# Altium schematic sheet STM32F103最小系统板.SchDoc
size A3
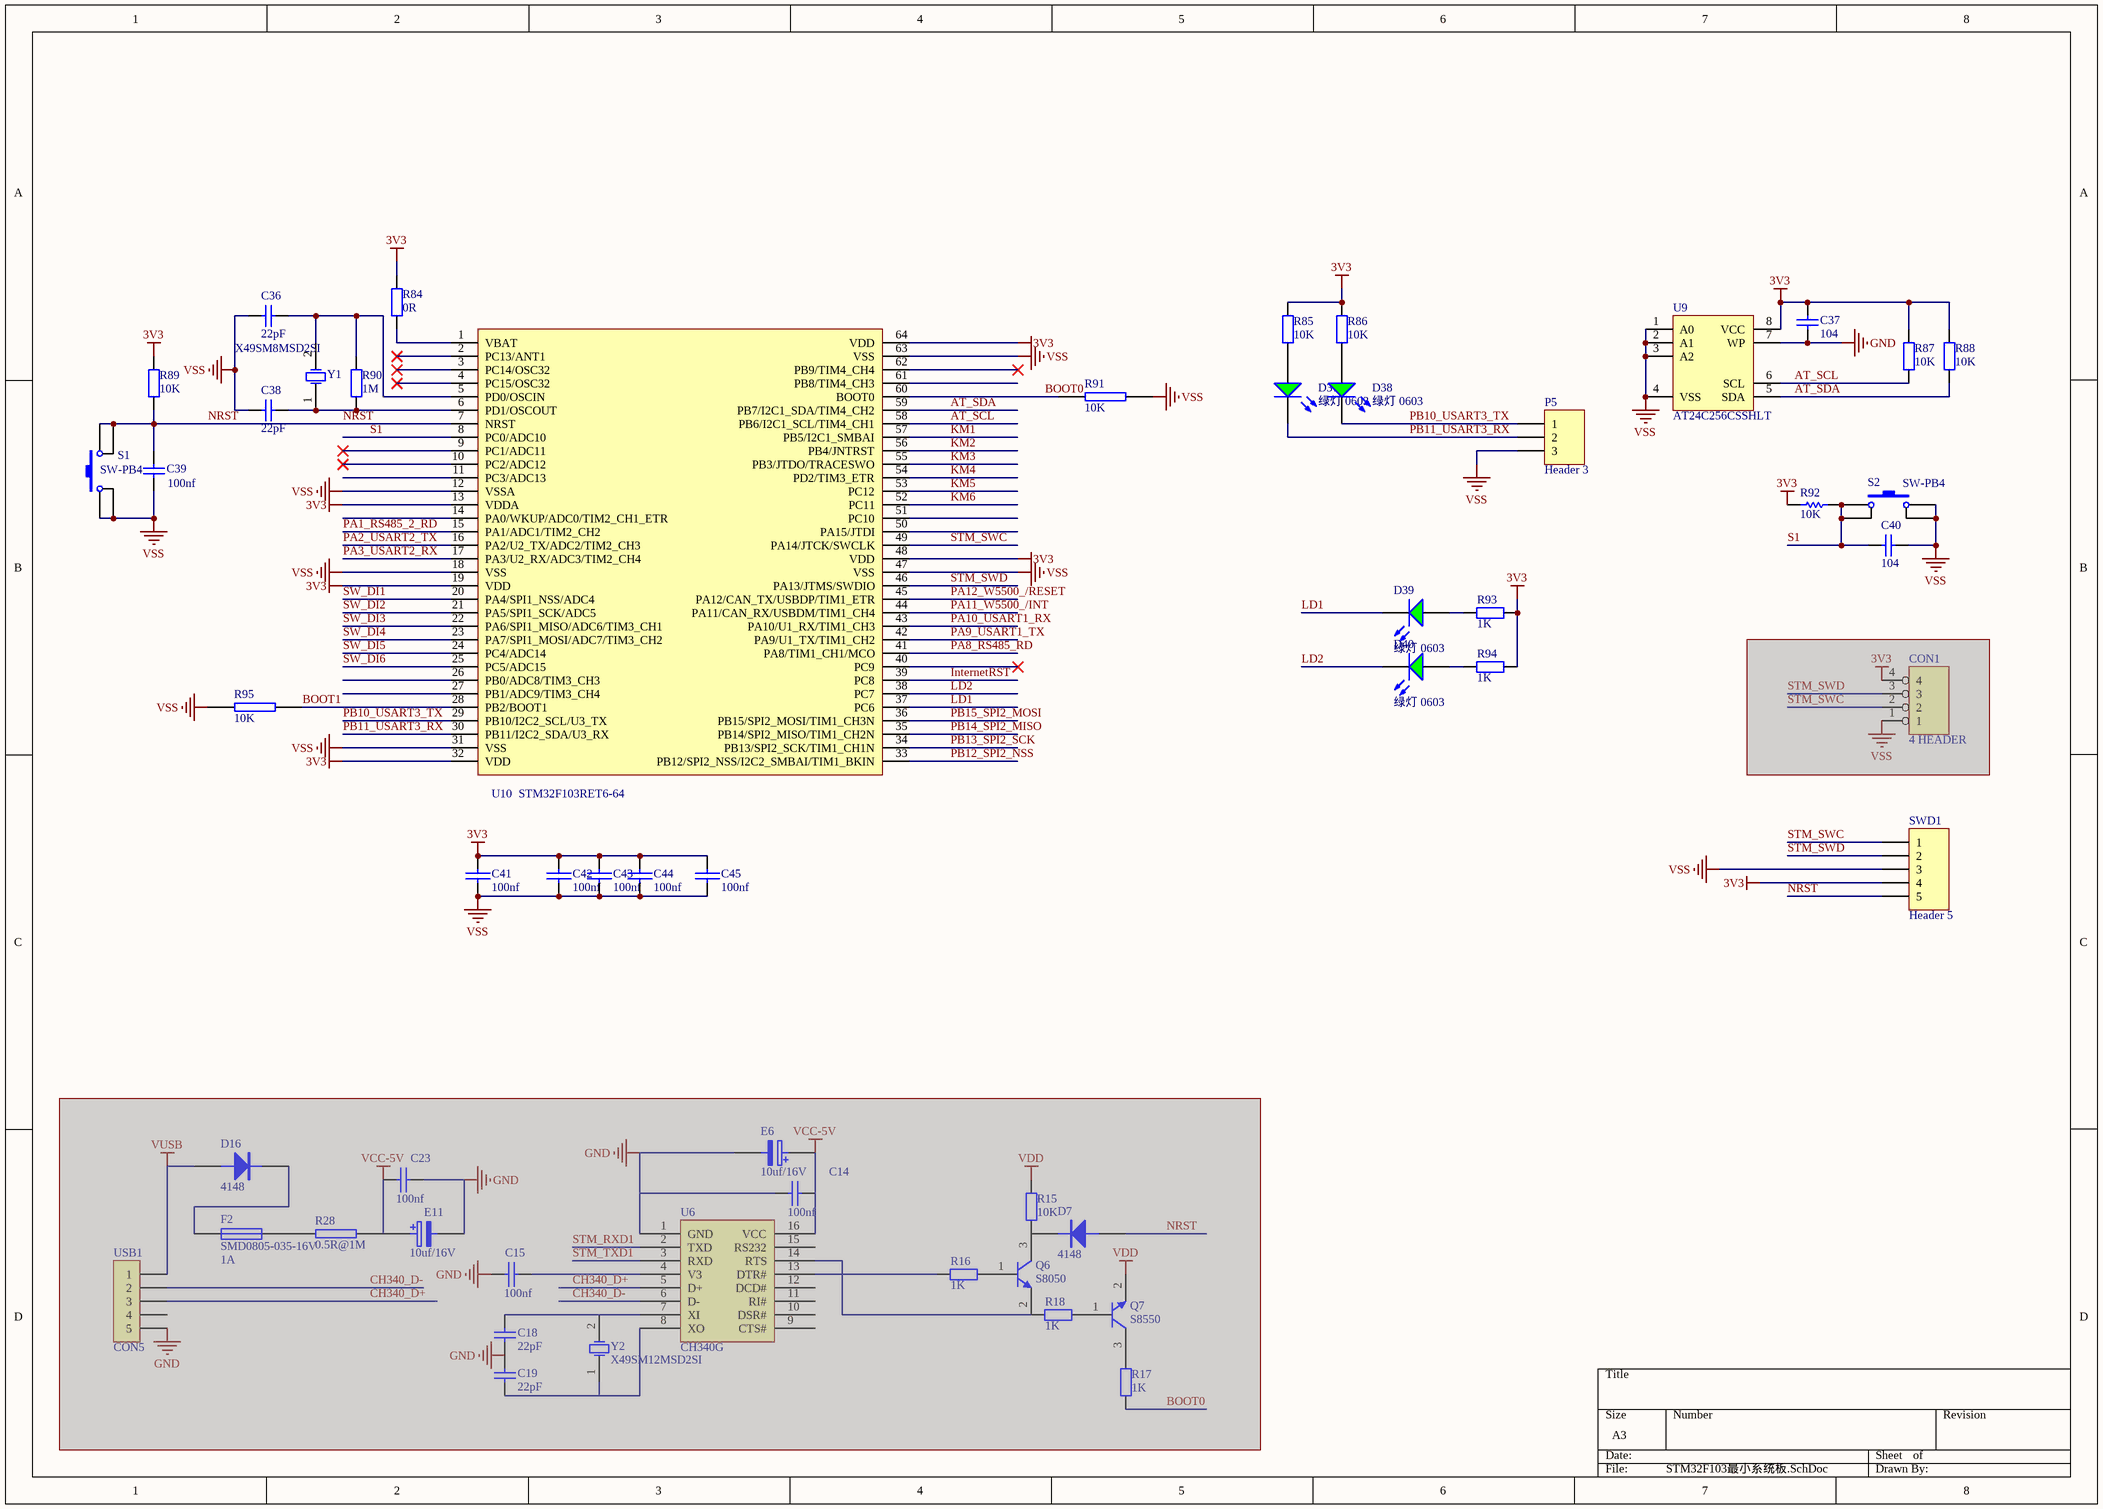
[diagram p0: STM32F103最小系统板.SchDoc]

## Parts
C14  100nf  [LC-0603_C]  (masked out: inside a compile mask, not in the netlist)
C15  100nf  [LC-0603_C]  (masked out: inside a compile mask, not in the netlist)
C18  22pF  [LC-0603_C]  (masked out: inside a compile mask, not in the netlist)
C19  22pF  [LC-0603_C]  (masked out: inside a compile mask, not in the netlist)
C23  100nf  [LC-0603_C]  (masked out: inside a compile mask, not in the netlist)
C36  22pF  [LC-0603_C]
C37  104  [LC-0603_C]
C38  22pF  [LC-0603_C]
C39  100nf  [LC-0603_C]
C40  104  [LC-0603_C]
C41  100nf  [LC-0603_C]
C42  100nf  [LC-0603_C]
C43  100nf  [LC-0603_C]
C44  100nf  [LC-0603_C]
C45  100nf  [LC-0603_C]
CON1  4 HEADER  [sip4]  (masked out: inside a compile mask, not in the netlist)
D7  4148  [LC-LL-34]  (masked out: inside a compile mask, not in the netlist)
D16  4148  [LC-LL-34]  (masked out: inside a compile mask, not in the netlist)
D37  绿灯 0603  [LC-0603_LED_S1]
D38  绿灯 0603  [LC-0603_LED_S1]
D39  绿灯 0603  [LC-0603_LED_S1]
D40  绿灯 0603  [LC-0603_LED_S1]
E6  10uf/16V  [LC-CASE-A_3216]  (masked out: inside a compile mask, not in the netlist)
E11  10uf/16V  [LC-CASE-A_3216]  (masked out: inside a compile mask, not in the netlist)
F2  SMD0805-035-16V  value 1A  [LC-0805_R]  (masked out: inside a compile mask, not in the netlist)
P5  Header 3  [HDR1X3]
Q6  S8050  [LC-SOT-23(SOT-23-3)]  (masked out: inside a compile mask, not in the netlist)
Q7  S8550  [LC-SOT-23(SOT-23-3)]  (masked out: inside a compile mask, not in the netlist)
R15  10K  [LC-0603_R]  (masked out: inside a compile mask, not in the netlist)
R16  1K  [LC-0603_R]  (masked out: inside a compile mask, not in the netlist)
R17  1K  [LC-0603_R]  (masked out: inside a compile mask, not in the netlist)
R18  1K  [LC-0603_R]  (masked out: inside a compile mask, not in the netlist)
R28  0.5R@1M  [LC-0805_R]  (masked out: inside a compile mask, not in the netlist)
R84  0R  [LC-0603_R]
R85  10K  [LC-0603_R]
R86  10K  [LC-0603_R]
R87  10K  [LC-0603_R]
R88  10K  [LC-0603_R]
R89  10K  [LC-0603_R]
R90  1M  [LC-0603_R]
R91  10K  [LC-0603_R]
R92  10K  [LC-0603_R]
R93  1K  [LC-0603_R]
R94  1K  [LC-0603_R]
R95  10K  [LC-0603_R]
S1  SW-PB4  [SW_PB4_A1]
S2  SW-PB4  [SW_PB4_A1]
SWD1  Header 5  [SWD-5]
U6  CH340G  [LC-SOIC-16_150mil]
U9  AT24C256CSSHLT  [SOIC-8]
U10  STM32F103RET6-64  [LC-LQFP-64_10x10x05P]
USB1  CON5  [USB_MICRO]  (masked out: inside a compile mask, not in the netlist)
Y1  X49SM8MSD2SI  [LC-HC-49SMD]
Y2  X49SM12MSD2SI  [LC-HC-49SMD]  (masked out: inside a compile mask, not in the netlist)

## Nets
3V3: C37.1 C41.2 C42.2 C43.2 C44.2 C45.2 R84.1 R85.1 R86.1 R87.1 R88.1 R89.2 R92.2 R93.1 R94.1 SWD1.4 U9.8(VCC) U10.13(VDDA) U10.19(VDD) U10.32(VDD) U10.48(VDD) U10.64(VDD)
GND: C37.2 U9.7(WP)
VSS: C36.1 C38.1 C39.1 C40.1 C41.1 C42.1 C43.1 C44.1 C45.1 P5.3 R91.1 R95.1 S1.1 S1.4 S2.2 S2.3 SWD1.3 U9.1(A0) U9.2(A1) U9.3(A2) U9.4(VSS) U10.12(VSSA) U10.18(VSS) U10.31(VSS) U10.47(VSS) U10.63(VSS)
AT_SCL: R87.2 U9.6(SCL) U10.58(PB6/I2C1_SCL/TIM4_CH1)
AT_SDA: R88.2 U9.5(SDA) U10.59(PB7/I2C1_SDA/TIM4_CH2)
BOOT0: R91.2 U10.60(BOOT0)
BOOT1: R95.2 U10.28(PB2/BOOT1)
InternetRST: U10.39(PC8)
KM1: U10.57(PB5/I2C1_SMBAI)
KM2: U10.56(PB4/JNTRST)
KM3: U10.55(PB3/JTDO/TRACESWO)
KM4: U10.54(PD2/TIM3_ETR)
KM5: U10.53(PC12)
KM6: U10.52(PC11)
LD1: D39.K U10.37(PC6)
LD2: D40.K U10.38(PC7)
NRST: C39.2 R89.1 S1.2 S1.3 SWD1.5 U10.7(NRST)
PA1_RS485_2_RD: U10.15(PA1/ADC1/TIM2_CH2)
PA2_USART2_TX: U10.16(PA2/U2_TX/ADC2/TIM2_CH3)
PA3_USART2_RX: U10.17(PA3/U2_RX/ADC3/TIM2_CH4)
PA8_RS485_RD: U10.41(PA8/TIM1_CH1/MCO)
PA9_USART1_TX: U10.42(PA9/U1_TX/TIM1_CH2)
PA10_USART1_RX: U10.43(PA10/U1_RX/TIM1_CH3)
PA11_W5500_/INT: U10.44(PA11/CAN_RX/USBDM/TIM1_CH4)
PA12_W5500_/RESET: U10.45(PA12/CAN_TX/USBDP/TIM1_ETR)
PB10_USART3_TX: D38.K P5.1 U10.29(PB10/I2C2_SCL/U3_TX)
PB11_USART3_RX: D37.K P5.2 U10.30(PB11/I2C2_SDA/U3_RX)
PB12_SPI2_NSS: U10.33(PB12/SPI2_NSS/I2C2_SMBAI/TIM1_BKIN)
PB13_SPI2_SCK: U10.34(PB13/SPI2_SCK/TIM1_CH1N)
PB14_SPI2_MISO: U10.35(PB14/SPI2_MISO/TIM1_CH2N)
PB15_SPI2_MOSI: U10.36(PB15/SPI2_MOSI/TIM1_CH3N)
S1: C40.2 R92.1 S2.1 S2.4 U10.8(PC0/ADC10)
STM_SWC: SWD1.1 U10.49(PA14/JTCK/SWCLK)
STM_SWD: SWD1.2 U10.46(PA13/JTMS/SWDIO)
SW_DI1: U10.20(PA4/SPI1_NSS/ADC4)
SW_DI2: U10.21(PA5/SPI1_SCK/ADC5)
SW_DI3: U10.22(PA6/SPI1_MISO/ADC6/TIM3_CH1)
SW_DI4: U10.23(PA7/SPI1_MOSI/ADC7/TIM3_CH2)
SW_DI5: U10.24(PC4/ADC14)
SW_DI6: U10.25(PC5/ADC15)
NetC36_2: C36.2 R90.2 U10.5(PD0/OSCIN) Y1.2(OSC2)
NetC38_2: C38.2 R90.1 U10.6(PD1/OSCOUT) Y1.1(OSC1)
NetD37_A: D37.A R85.2
NetD38_A: D38.A R86.2
NetD39_A: D39.A R93.2
NetD40_A: D40.A R94.2
NetR84_2: R84.2 U10.1(VBAT)

Not connected (* = marked no-connect by the designer): U6 1(GND) 2(TXD) 3(RXD) 4(V3) 5(D+) 6(D-) 7(XI) 8(XO) 9(CTS#) 10(DSR#) 11(RI#) 12(DCD#) 13(DTR#) 14(RTS) 15(RS232) 16(VCC); U10 2(PC13/ANT1)* 3(PC14/OSC32)* 4(PC15/OSC32)* 9(PC1/ADC11)* 10(PC2/ADC12)* 11(PC3/ADC13) 14(PA0/WKUP/ADC0/TIM2_CH1_ETR) 26(PB0/ADC8/TIM3_CH3) 27(PB1/ADC9/TIM3_CH4) 40(PC9)* 50(PA15/JTDI) 51(PC10) 61(PB8/TIM4_CH3) 62(PB9/TIM4_CH4)*

## Library data of the parts
C14 C15 C23 C41-C45 = CAP: Capacitor
C18 C19 C36 C38 = Cap: Capacitor; Published: 8-Jun-2000; LatestRevisionDate: 17-Jul-2002; LatestRevisionNote: Re-released for DXP Platform.; PackageReference: RAD-0.3; Publisher: Altium Limited; Value: 22pF
C37 C40 = CAP: Capacitor; Value: 100nF; Published: 8-Jun-2000; Revision: July-2002: Re-released for DXP Platform.; Publisher: Altium Limited
C39 = Cap: Capacitor; Value: 0.1uF; Published: 8-Jun-2000; LatestRevisionDate: 17-Jul-2002; LatestRevisionNote: Re-released for DXP Platform.; PackageReference: RAD-0.3; Publisher: Altium Limited
CON1 = 4 HEADER: 4 Pin Header
D7 D16 = DIODE
D37-D40 = 0: 发光二极管; ComponentLink1Description: 供应商链接; ComponentLink1URL: http://www.szlcsc.com/product/details_73152.html; Package: 0603; Supplier: LC; SuppliersPartNumber: C72043
E6 E11 = ELECTRO2: Electrolytic Capacitor
F2 = F: 保险丝
P5 = Header 3: Header, 3-Pin; LatestRevisionDate: 17-Jul-2002; LatestRevisionNote: Re-released for DXP Platform.; Publisher: Altium Limited
Q7 = S8050
R15 R85-R89 = Res2: Resistor; Published: 8-Jun-2000; LatestRevisionDate: 17-Jul-2002; LatestRevisionNote: Re-released for DXP Platform.; PackageReference: AXIAL-0.4; Publisher: Altium Limited; Value: 10K
R16-R18 R84 R90 = Res2: Resistor; Value: 10K; Published: 8-Jun-2000; LatestRevisionDate: 17-Jul-2002; LatestRevisionNote: Re-released for DXP Platform.; PackageReference: AXIAL-0.4; Publisher: Altium Limited
R28 R91 R95 = RES2
R92 = res1: Resistor; Published: 8-Jun-2000; Revision: July-2002: Re-released for DXP Platform.; Publisher: Altium Limited; Value: 10K
R93 R94 = R: 贴片电阻; Published: 8-Jun-2000; LatestRevisionDate: 17-Jul-2002; LatestRevisionNote: Re-released for DXP Platform.; PackageReference: AXIAL-0.4; Publisher: Altium Limited; Value: 1K
S1 = SW-: 微动开关; Published: 24-Mar-1999; LatestRevisionDate: 17-Jul-2002; LatestRevisionNote: Re-released for DXP Platform.; PackageReference: SPST-2; Publisher: Altium Limited
S2 = SW-PB4: 微动开关; Published: 24-Mar-1999; LatestRevisionDate: 17-Jul-2002; LatestRevisionNote: Re-released for DXP Platform.; PackageReference: SPST-2; Publisher: Altium Limited
SWD1 = Header 5: Header, 5-Pin; LatestRevisionDate: 17-Jul-2002; LatestRevisionNote: Re-released for DXP Platform.; Publisher: Altium Limited
U9 = AT24C02: EEROM存储器
U10 = STM32F103RBT6
USB1 = CON5: Connector
Y1 Y2 = XTAL: Crystal Oscillator; Published: 8-Jun-2000; LatestRevisionDate: 17-Jul-2002; LatestRevisionNote: Re-released for DXP Platform.; PackageReference: R38; Publisher: Altium Limited